# EAGLE schematic openSX70_ALADDIN_V39_20180122 (EAGLE 8.5.1)
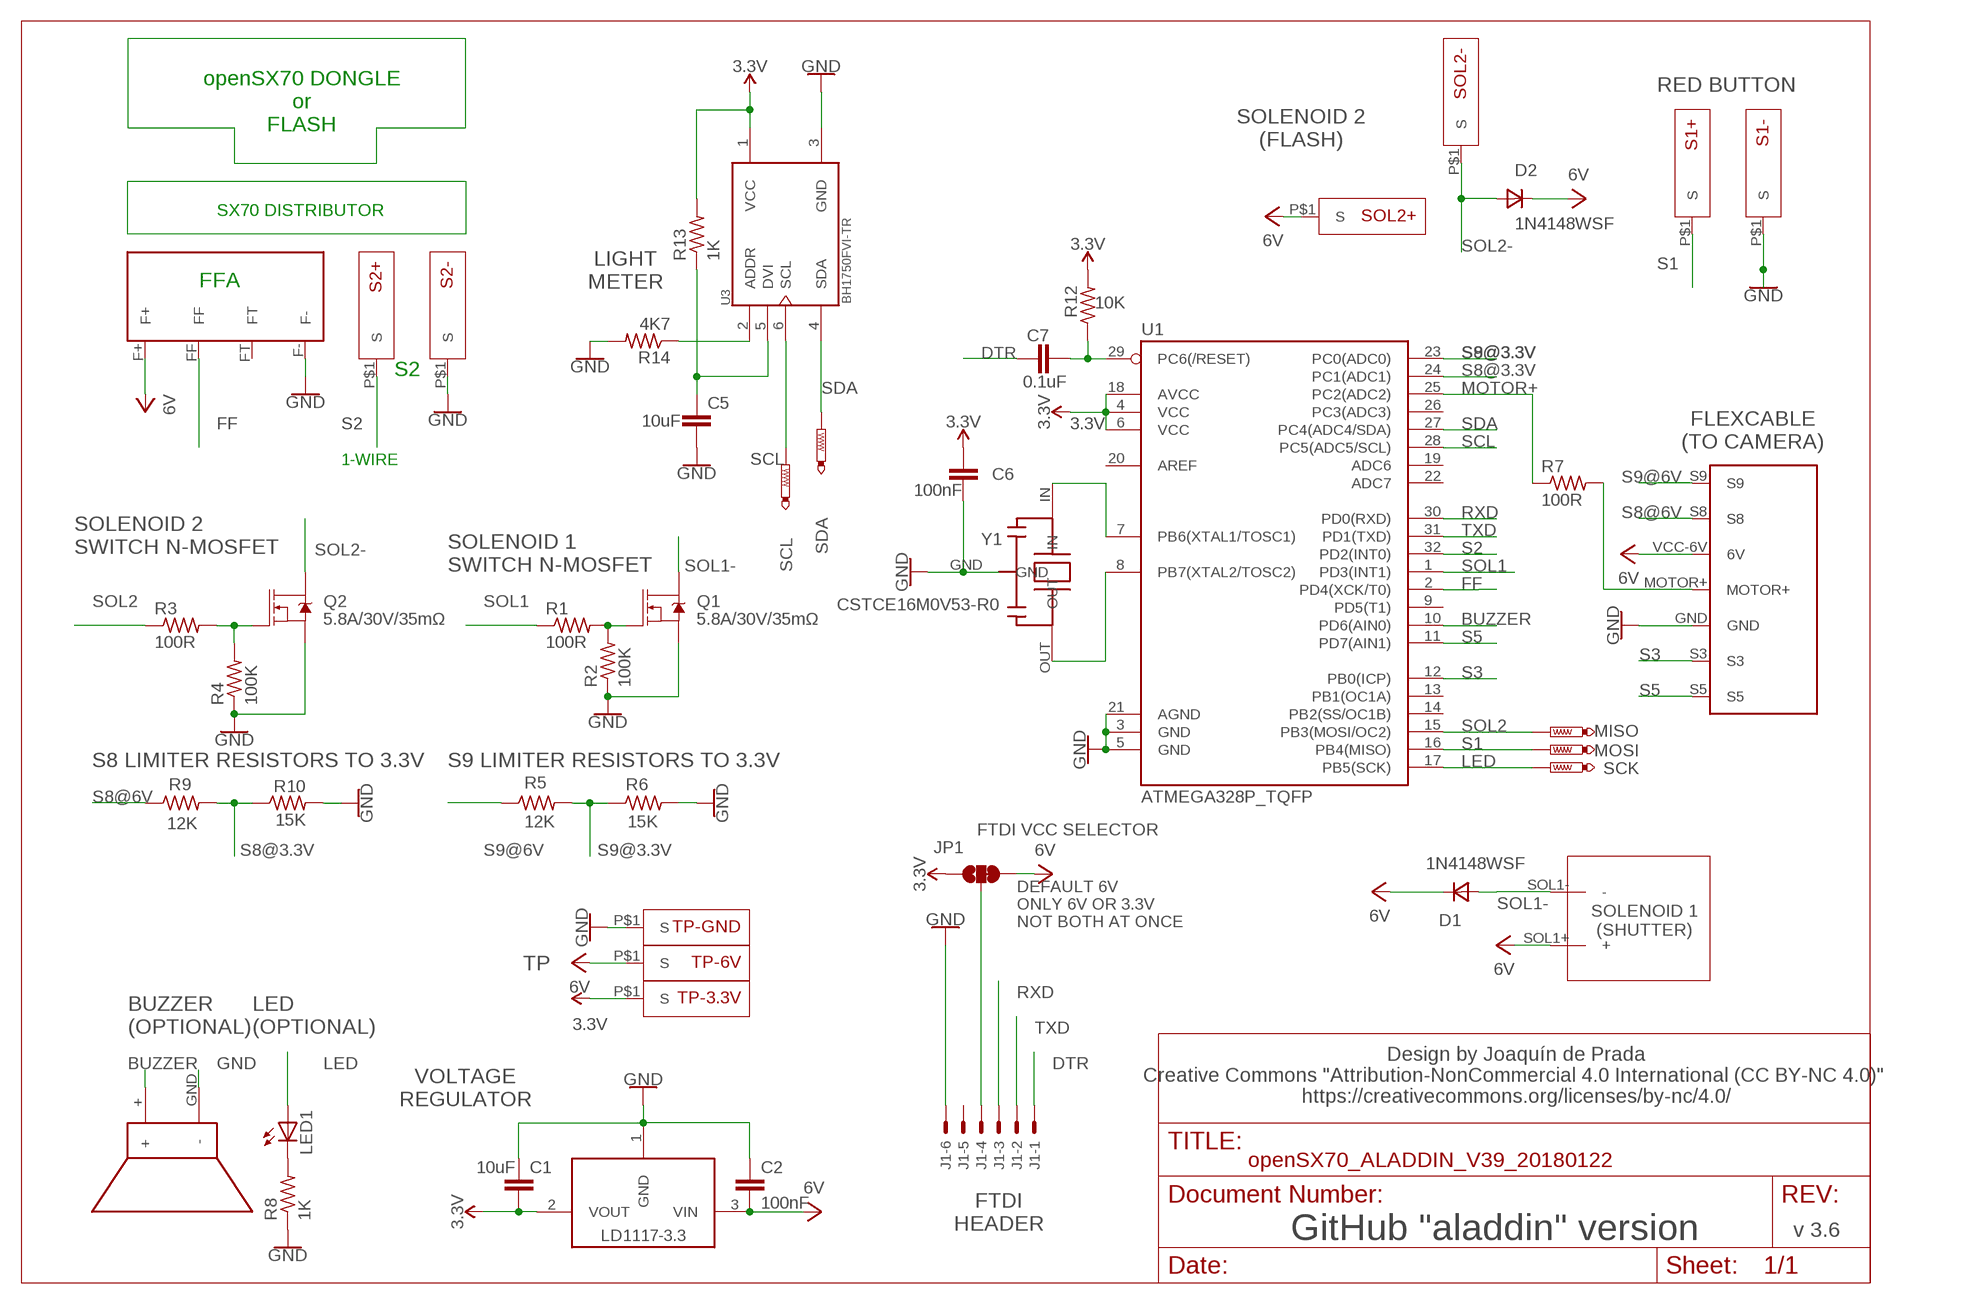
[diagram p0: schematic, sheet 1]

## Parts
BUZZ1  CSET8-5G  [CSET8-5G_PACKAGE]
C1  10uF  10UF-0603-6.3V-20%  [0603]
C2  100nF  C-EUC0603K  [C0603K]
C5  10uF  10UF-0603-6.3V-20%  [0603]
C6  100nF  C-EUC0603  [C0603]
C7  0.1uF  0.1UF-0603-25V-(+80/-20%)  [0603]
D1  1N4148WSF  DSOD323  [SOD323]
D2  1N4148WSF  DSOD323  [SOD323]
J1  GND  XF2L-0625-1  [XF2L-0625-1]
JP1  FTDI VCC SELECTOR  JUMPER-SMT_3_1-NC_TRACE_SILK  [SMT-JUMPER_3_1-NC_TRACE_SILK]
LD11173.3V  LD1117 3.3V  LD1117-3.3  [SOT223]
LED1  LEDCHIPLED_0805  [CHIPLED_0805]
MISO  PTR1TP08R  [TP08R]
MOSI  PTR1TP08R  [TP08R]
Q1  5.8A/30V/35mΩ  MOSFET-NCH-AO3404A  [SOT23-3]
Q2  5.8A/30V/35mΩ  MOSFET-NCH-AO3404A  [SOT23-3]
R1  100R  R-US_R0603  [R0603]
R2  100K  R-US_R0603  [R0603]
R3  100R  R-US_R0603  [R0603]
R4  100K  R-US_R0603  [R0603]
R5  12K  R-US_R0603  [R0603]
R6  15K  R-US_R0603  [R0603]
R7  100R  R-US_R0603  [R0603]
R8  1K  R-US_R0603  [R0603]
R9  12K  R-US_R0603  [R0603]
R10  15K  R-US_R0603  [R0603]
R12  10K  R-US_R0603  [R0603]
R13  1K  R-US_R0603  [R0603]
R14  4K7  R-US_R0603  [R0603]
S1+  SX70-S-PAD-NEW  [SX70-S-PAD2]
S1-  SX70-S-PAD-NEW  [SX70-S-PAD2]
S2+  SX70-S-PAD-NEW  [SX70-S-PAD2]
S2-  SX70-S-PAD-NEW  [SX70-S-PAD2]
SCK  PTR1TP08R  [TP08R]
SCL  PTR1TP08R  [TP08R]
SDA  PTR1TP08R  [TP08R]
SOL1  SX70-SOLENOID1-2PADS  [SX70-SOLENOID1-2]
SOL2+  SX70-S-PAD-NEW  [SX70-S-PAD2]
SOL2-  SX70-S-PAD-NEW  [SX70-S-PAD2]
TP-3.3V  SX70-S-PAD-NEW  [SX70-S-PAD2]
TP-6V  SX70-S-PAD-NEW  [SX70-S-PAD2]
TP-GND  SX70-S-PAD-NEW  [SX70-S-PAD2]
U1  ATMEGA328P_TQFP  [TQFP32-08]
U3  BH1750FVI-TR  [SOTFL50P300X75-6N]
U$1  SX70-7-PAD  [SX70-7-PAD]
U$2  FFA  SX70-FFA-PAD  [FFA-PAD-PACKAGE]
Y1  CSTCE16M0V53-R0  [CFP95P160X100-3N]

## Nets
3.3V: C1.2 C6.1 JP1.1 LD11173.3V.2(VOUT) R12.2 R13.2 TP-3.3V.P$1(S) U1.4(VCC) U1.6(VCC) U1.18(AVCC) U3.1(VCC)
6V: C2.2 D1.1(C) D2.1(C) JP1.3 LD11173.3V.3(VIN) SOL1.SOL1+(+) SOL2+.P$1(S) TP-6V.P$1(S) U$1.VCC-6V(6V) U$2.F+
BUZZER: BUZZ1.+ U1.10(PD6(AIN0))
DTR: C7.1 J1.1
FF: U1.2(PD4(XCK/T0)) U$2.FF
GND: BUZZ1.GND(-) C1.1 C2.1 C5.2 C6.2 J1.6 LD11173.3V.1(GND) Q1.2(S) Q2.2(S) R2.1 R4.1 R6.2 R8.1 R10.2 R14.2 S1-.P$1(S) S2-.P$1(S) TP-GND.P$1(S) U1.3(GND) U1.5(GND) U1.21(AGND) U3.3(GND) U$1.GND U$2.F- Y1.GND
LED: LED1.A SCK.TP U1.17(PB5(SCK))
MOTOR+: R7.1 U1.25(PC2(ADC2))
MOTOR-HEADER: R7.2 U$1.MOTOR+
N$1: Q1.1(G) R1.2 R2.2
N$2: C5.1 R13.1 U3.5(DVI)
N$3: Q2.1(G) R3.2 R4.2
N$4: U1.7(PB6(XTAL1/TOSC1)) Y1.IN
N$5: LED1.C R8.2
N$6: U1.8(PB7(XTAL2/TOSC2)) Y1.OUT
N$9: C7.2 R12.1 U1.29(PC6(/RESET))
N$10: R14.1 U3.2(ADDR)
N$27: J1.4
RXD: J1.3 U1.30(PD0(RXD))
S1: MOSI.TP S1+.P$1(S) U1.16(PB4(MISO))
S2: S2+.P$1(S) U1.32(PD2(INT0))
S3: U1.12(PB0(ICP)) U$1.S3
S5: U1.11(PD7(AIN1)) U$1.S5
S8@3.3V: R9.2 R10.1 U1.24(PC1(ADC1))
S8@6V: R9.1 U$1.S8
S9@3.3V: R5.2 R6.1 U1.23(PC0(ADC0))
S9@6V: R5.1 U$1.S9
SCL: SCL.TP U1.28(PC5(ADC5/SCL)) U3.6(SCL)
SDA: SDA.TP U1.27(PC4(ADC4/SDA)) U3.4(SDA)
SOL1: R1.1 U1.1(PD3(INT1))
SOL1-: D1.2(A) Q1.3(D) SOL1.SOL1-(-)
SOL2: MISO.TP R3.1 U1.15(PB3(MOSI/OC2))
SOL2-: D2.2(A) Q2.3(D) SOL2-.P$1(S)
TXD: J1.2 U1.31(PD1(TXD))
Unconnected: J1.5 JP1.2 U1.9(PD5(T1)) U1.13(PB1(OC1A)) U1.14(PB2(SS/OC1B)) U1.19(ADC6) U1.20(AREF) U1.22(ADC7) U1.26(PC3(ADC3)) U$2.FT

## Notes on the sheet
- RED BUTTON
- openSX70 DONGLE
  or
  FLASH
- SOLENOID 2
  (FLASH)
- SX70 DISTRIBUTOR
- LIGHT
  METER
- FFA
- S2
- FLEXCABLE
  (TO CAMERA)
- 1-WIRE
- SOLENOID 2
  SWITCH N-MOSFET
- SOLENOID 1
  SWITCH N-MOSFET
- S8 LIMITER RESISTORS TO 3.3V | S9 LIMITER RESISTORS TO 3.3V
- SOLENOID 1
  (SHUTTER)
- DEFAULT 6V
  ONLY 6V OR 3.3V
  NOT BOTH AT ONCE
- TP
- BUZZER
  (OPTIONAL)
- LED
  (OPTIONAL)
- Design by Joaquín de Prada
  Creative Commons "Attribution-NonCommercial 4.0 International (CC BY-NC 4.0)" 
  https://creativecommons.org/licenses/by-nc/4.0/
- VOLTAGE
  REGULATOR
- FTDI
  HEADER
- v 3.6
- GitHub "aladdin" version

## Library data of the parts
BUZZ1 = openSX70:CSET8-5G
C1 C5 = SparkFun-Capacitors:10UF: 10.0µF ceramic capacitors A capacitor is a passive two-terminal electrical component used to store electrical energy temporarily in an electric field.; PROD_ID: CAP-11015
C2 C6 = rcl:C-EU: CAPACITOR, European symbol; SPICEPREFIX: C
C7 = SparkFun-Capacitors:0.1UF: 0.1µF ceramic capacitors A capacitor is a passive two-terminal electrical component used to store electrical energy temporarily in an electric field.; PROD_ID: CAP-00810
D1 D2 = zetex:D: DIODE; MPN: CDSOD323-T05C; OC_FARNELL: 1824860; OC_NEWARK: 79R6078
J1 = con-omron:XF2*-06?: OMRON FPC Connector Source : http://www.omron.com/ecb/products/pdf/fpc.pdf; MF: OMRON COMPONENTS USA; MPN: XF2L-0625-1; OC_FARNELL: 1536105; OC_NEWARK: 29C7842
JP1 = SparkFun-Jumpers:JUMPER-SMT_3_1-NC_TRACE: Normally closed trace jumper (1 of 2 connections) This jumper has a trace between two pads so it's normally closed (NC). The other connection is normally open (NO). Use a razor knife to open the connection. For best results follow the IPC guidelines for cutting traces: Cutout at least 0.063 mm (0.005 in). Remove all loose material to clean up the cut area. Seal the cut with an approved epoxy. Reapply solder to reclose the connection, or to close the NO connection.
LD11173.3V = openSX70:LD1117-3.3; AVAILABILITY: Unavailable; DESCRIPTION: Sot223/Pkg 1-Amp 5-Volt Low Drop Out Voltage Regulatator; MF: Advanced Monolithic Systems; MP: AMS1117-5.0; PACKAGE: None; PRICE: None
LED1 = led:LED: LED OSRAM: - CHIPLED LG R971, LG N971, LY N971, LG Q971, LY Q971, LO R971, LY R971 LH N974, LH R974 LS Q976, LO Q976, LY Q976 LO Q996 - Hyper CHIPLED LW Q18S LB Q993, LB Q99A, LB R99A - SideLED LS A670, LO A670, LY A670, LG A670, LP A670 LB A673, LV A673, LT A673, LW A673 LH A674 LY A675 LS A676, LA A676, LO A676, LY A676, LW A676 LS A679, LY A679, LG A679 - Hyper Micro SIDELED® LS Y876, LA Y876, LO Y876, LY Y876 LT Y87S - SmartLED LW L88C, LW L88S LB L89C, LB L89S, LG L890 LS L89K, LO L89K, LY L89K LS L896, LA L896, LO L896, LY L896 - TOPLED LS T670, LO T670, LY T670, LG T670, LP T670 LSG T670, LSP T670, LSY T670, LOP T670, LYG T670 LG T671, LOG T671, LSG T671 LB T673, LV T673, LT T673, LW T673 LH T674 LS T676, LA T676, LO T676, LY T676, LB T676, LH T676, LSB T676, LW T676 LB T67C, LV T67C, LT T67C, LS T67K, LO T67K, LY T67K, LW E67C LS E67B, LA E67B, LO E67B, LY E67B, LB E67C, LV E67C, LT E67C LW T67C LS T679, LY T679, LG T679 LS T770, LO T770, LY T770, LG T770, LP T770 LB T773, LV T773, LT T773, LW T773 LH T774 LS E675, LA E675, LY E675, LS T675 LS T776, LA T776, LO T776, LY T776, LB T776 LHGB T686 LT T68C, LB T68C - Hyper Mini TOPLED® LB M676 - Mini TOPLED Santana® LG M470 LS M47K, LO M47K, LY M47K Source: http://www.osram.convergy.de LUXEON: - LUMILED® LXK2-PW12-R00, LXK2-PW12-S00, LXK2-PW14-U00, LXK2-PW14-V00 LXK2-PM12-R00, LXK2-PM12-S00, LXK2-PM14-U00 LXK2-PE12-Q00, LXK2-PE12-R00, LXK2-PE12-S00, LXK2-PE14-T00, LXK2-PE14-U00 LXK2-PB12-K00, LXK2-PB12-L00, LXK2-PB12-M00, LXK2-PB14-N00, LXK2-PB14-P00, LXK2-PB14-Q00 LXK2-PR12-L00, LXK2-PR12-M00, LXK2-PR14-Q00, LXK2-PR14-R00 LXK2-PD12-Q00, LXK2-PD12-R00, LXK2-PD12-S00 LXK2-PH12-R00, LXK2-PH12-S00 LXK2-PL12-P00, LXK2-PL12-Q00, LXK2-PL12-R00 Source: www.luxeon.com KINGBRIGHT: KA-3528ASYC Source: www.kingbright.com
MISO MOSI SCK SCL SDA = testpad:PTR1: TEST PIN
Q1 Q2 = openSX70:MOSFET-NCH: N-channel MOSFETs Voltage controlled devices that allow control of high current outputs. SparkFun Products: SparkFun OpenScale <https://www.sparkfun.com/products/13261> SparkFun Digital Sandbox <https://www.sparkfun.com/products/12651> SparkFun Monster Moto Shield <https://www.sparkfun.com/products/10182> SparkFun MOSFET Power Controller <https://www.sparkfun.com/products/11214>; PROD_ID: TRANS-12988
R1-R10 R12-R14 = resistor:R-US_: RESISTOR, American symbol
S1+ S1- S2+ S2- SOL2+ SOL2- TP-3.3V TP-6V TP-GND = openSX70:SX70-S-PAD-NEW
SOL1 = openSX70:SX70-SOLENOID1-2PADS
U1 = openSX70:ATMEGA328P_TQFP: Popular 328P in QFP Storefront component: ATmega328 - TQFP <https://www.sparkfun.com/products/13448> (COM-13448) Datasheet <http://www.sparkfun.com/datasheets/Components/SMD/ATMega328.pdf> SparkFun Products SparkFun RedBoard - Programmed with Arduino <https://www.sparkfun.com/products/12757> (DEV-12757) Arduino Pro Mini 328 - 5V/16MHz <https://www.sparkfun.com/products/11113> (DEV-11113) Arduino Pro Mini 328 - 3.3V/8MHz <https://www.sparkfun.com/products/11114> (DEV-11114) SparkFun OpenLog <https://www.sparkfun.com/products/13712> (DEV-13712) SparkFun MicroView - OLED Arduino Module <https://www.sparkfun.com/products/12923> (DEV-12923) SparkFun Digital Sandbox <https://www.sparkfun.com/products/12651> (DEV-12651) SparkFun PicoBoard <https://www.sparkfun.com/products/11888> (WIG-11888) Arduino Fio <https://www.sparkfun.com/products/10116> (DEV-10116) LilyPad Arduino 328 Main Board <https://www.sparkfun.com/products/13342> (DEV-13342) SparkFun RedStick <https://www.sparkfun.com/products/13741> (DEV-13741) LilyPad MP3 <https://www.sparkfun.com/products/11013> (DEV-11013) LilyPad Arduino SimpleSnap <https://www.sparkfun.com/products/10941> (DEV-10941) SparkFun Stepoko <https://www.sparkfun.com/products/13899> (ROB-13899) SparkFun Geiger Counter <https://www.sparkfun.com/products/11345> (SEN-11345) SparkFun EL Sequencer <https://www.sparkfun.com/products/12781> (COM-12781) Arduino Pro 328 - 5V/16MHz <https://www.sparkfun.com/products/10915> (DEV-10915) CryptoCape <https://www.sparkfun.com/products/12773> (DEV-12773) SparkFun IR Thermometer Evaluation Board - MLX90614 <https://www.sparkfun.com/products/10740> (SEN-10740) SparkFun RedBot Mainboard <https://www.sparkfun.com/products/12097> (ROB-12097) Arduino Pro 328 - 3.3V/8MHz <https://www.sparkfun.com/products/10914> (DEV-10914) SparkFun Block for Intel® Edison - Arduino <https://www.sparkfun.com/products/13036> (DEV-13036) SparkFun Simon Says - Surface Mount Soldering Kit <https://www.sparkfun.com/products/10935> (KIT-10935) SparkFun 7-Segment Serial Display - Red <https://www.sparkfun.com/products/11441> (COM-11441) SparkFun 7-Segment Serial Display - White <https://www.sparkfun.com/products/11629> (COM-11629) SparkFun 7-Segment Serial Display - Yellow <https://www.sparkfun.com/products/11443> (COM-11443) SparkFun 7-Segment Serial Display - Kelly Green <https://www.sparkfun.com/products/11440> (COM-11440) SparkFun 7-Segment Serial Display - Blue <https://www.sparkfun.com/products/11442> (COM-11442) SparkFun OpenSegment Serial Display - 20mm (Blue) <https://www.sparkfun.com/products/11647> (COM-11647) SparkFun OpenSegment Serial Display - 20mm (Green) <https://www.sparkfun.com/products/11646> (COM-11646) SparkFun OpenSegment Serial Display - 20mm (White) <https://www.sparkfun.com/products/11648> (COM-11648) SparkFun OpenSegment Serial Display - 20mm (Red) <https://www.sparkfun.com/products/11644> (COM-11644) SparkFun OpenSegment Serial Display - 20mm (Yellow) <https://www.sparkfun.com/products/11645> (COM-11645) SparkFun OpenSegment Shield <https://www.sparkfun.com/products/13190> (DEV-13190); PROD_ID: IC-09069
U3 = openSX70:BH1750FVI-TR: Light to Digital Ambient Light Sensor Digital O/P 1lux to 65535lux 6-Pin WSOF Embossed T/R; AVAILABILITY: Good; DESCRIPTION: Light to Digital Ambient Light Sensor Digital O/P 1lux to 65535lux 6-Pin WSOF Embossed T/R; MF: Rohm; MP: BH1750FVI-TR; PACKAGE: SMD-6 Rohm; PRICE: 2.38 USD
U$1 = openSX70:SX70-7-PAD
U$2 = openSX70:SX70-FFA-PAD
Y1 = CSTCE16M0V53-R0:CSTCE16M0V53-R0: Ceramic Resonator 16MHz ±0.5% (Tol) ±0.3% (Stability) 15pF 40Ohm 3-Pin CSMD T/R; AVAILABILITY: Good; DESCRIPTION: Ceramic Resonator 16MHz ??0.5% (Tol) ??0.3% (Stability) 15pF 40Ohm 3-Pin CSMD T/R; MF: Murata; MP: CSTCE16M0V53-R0; PACKAGE: SMD-3 Murata; PRICE: 0.28 USD